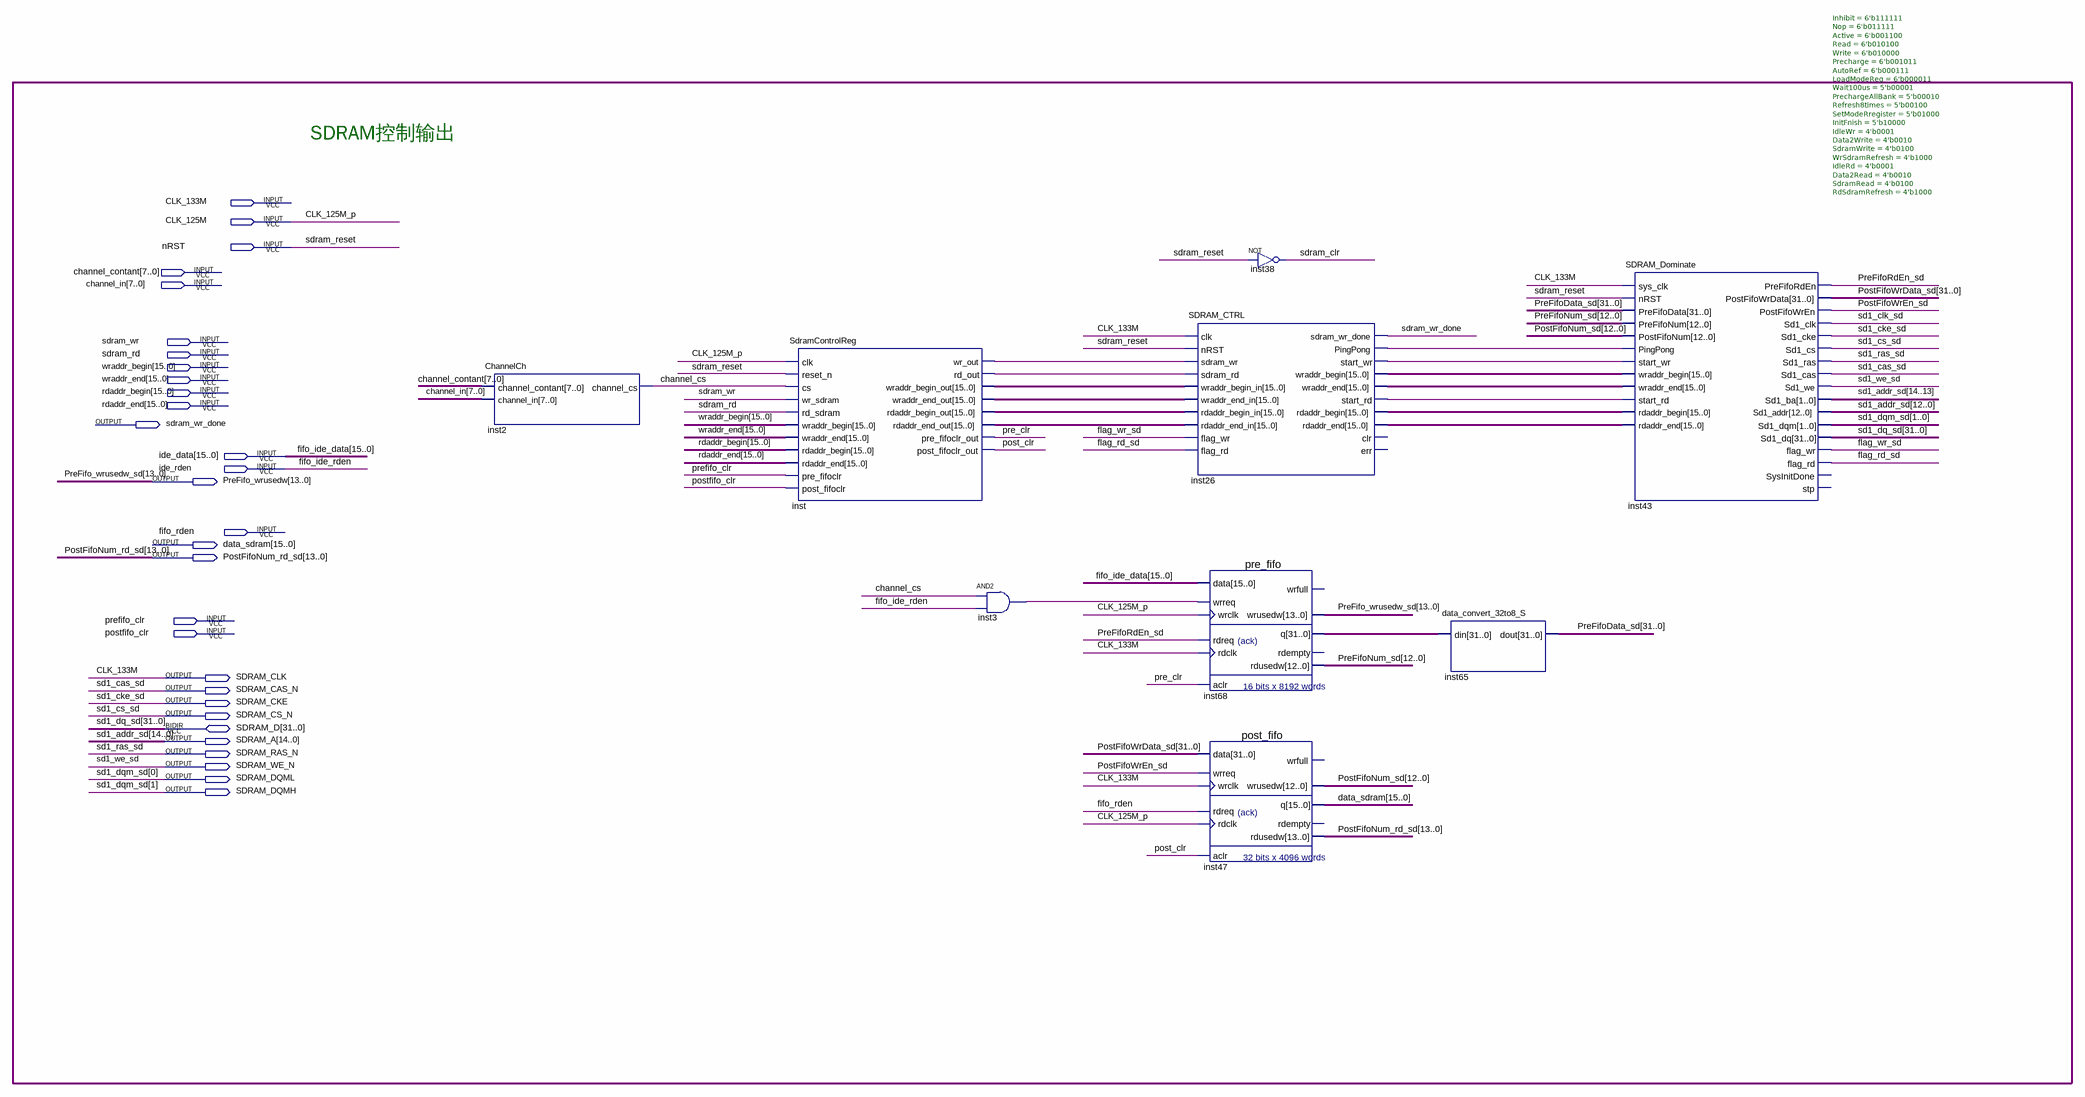
[diagram p0: schematic sheet]
// Quartus schematic sdram_ctrl_blk.bdf as structural Verilog: 9 symbols, 30 pins
module sdram_ctrl_blk (
  input  CLK_133M,
  input  CLK_125M,
  input  nRST,
  input  [7:0] channel_contant,
  input  [7:0] channel_in,
  input  sdram_wr,
  input  sdram_rd,
  input  [15:0] wraddr_begin,
  input  [15:0] wraddr_end,
  input  [15:0] rdaddr_begin,
  input  [15:0] rdaddr_end,
  input  [15:0] ide_data,
  input  ide_rden,
  input  fifo_rden,
  input  prefifo_clr,
  input  postfifo_clr,
  inout  [31:0] SDRAM_D,
  output sdram_wr_done,
  output [13:0] PreFifo_wrusedw,
  output [15:0] data_sdram,
  output [13:0] PostFifoNum_rd_sd,
  output SDRAM_CLK,
  output SDRAM_CAS_N,
  output SDRAM_CKE,
  output SDRAM_CS_N,
  output [14:0] SDRAM_A,
  output SDRAM_RAS_N,
  output SDRAM_WE_N,
  output SDRAM_DQML,
  output SDRAM_DQMH
);

  wire channel_cs, flag_rd_sd, flag_wr_sd, inst3_out, inst26_pingpong, inst26_start_rd, inst26_start_wr,
       inst_rd_out, inst_wr_out, post_clr, PostFifoWrEn_sd, pre_clr, PreFifoRdEn_sd, sd1_clk_sd, sdram_clr;
  wire [12:0] PostFifoNum_sd, PreFifoNum_sd;
  wire [15:0] inst26_rdaddr_begin, inst26_rdaddr_end, inst26_wraddr_begin, inst26_wraddr_end,
       inst_rdaddr_begin_out, inst_rdaddr_end_out, inst_wraddr_begin_out, inst_wraddr_end_out;
  wire [31:0] inst68_q, PostFifoWrData_sd, PreFifoData_sd;

  ChannelCh inst2 (.channel_contant(channel_contant), .channel_in(channel_in), .channel_cs(channel_cs));
  SdramControlReg inst (
    .clk(CLK_125M), .reset_n(nRST), .cs(channel_cs), .wr_sdram(sdram_wr), .rd_sdram(sdram_rd),
    .wraddr_begin(wraddr_begin), .wraddr_end(wraddr_end), .rdaddr_begin(rdaddr_begin),
    .rdaddr_end(rdaddr_end), .pre_fifoclr(prefifo_clr), .post_fifoclr(postfifo_clr), .wr_out(inst_wr_out),
    .rd_out(inst_rd_out), .wraddr_begin_out(inst_wraddr_begin_out), .wraddr_end_out(inst_wraddr_end_out),
    .rdaddr_begin_out(inst_rdaddr_begin_out), .rdaddr_end_out(inst_rdaddr_end_out),
    .pre_fifoclr_out(pre_clr), .post_fifoclr_out(post_clr));
  and inst3 (inst3_out, channel_cs, ide_rden);
  SDRAM_CTRL inst26 (
    .clk(CLK_133M), .nRST(nRST), .sdram_wr(inst_wr_out), .sdram_rd(inst_rd_out),
    .wraddr_begin_in(inst_wraddr_begin_out), .wraddr_end_in(inst_wraddr_end_out),
    .rdaddr_begin_in(inst_rdaddr_begin_out), .rdaddr_end_in(inst_rdaddr_end_out), .flag_wr(flag_wr_sd),
    .flag_rd(flag_rd_sd), .sdram_wr_done(sdram_wr_done), .PingPong(inst26_pingpong),
    .start_wr(inst26_start_wr), .wraddr_begin(inst26_wraddr_begin), .wraddr_end(inst26_wraddr_end),
    .start_rd(inst26_start_rd), .rdaddr_begin(inst26_rdaddr_begin), .rdaddr_end(inst26_rdaddr_end));  // open: clr, err
  pre_fifo inst68 (
    .data(ide_data), .wrreq(inst3_out), .wrclk(CLK_125M), .rdreq(PreFifoRdEn_sd), .rdclk(CLK_133M),
    .aclr(pre_clr), .wrusedw(PreFifo_wrusedw), .q(inst68_q), .rdusedw(PreFifoNum_sd));  // open: wrfull, rdempty
  post_fifo inst47 (
    .data(PostFifoWrData_sd), .wrreq(PostFifoWrEn_sd), .wrclk(CLK_133M), .rdreq(fifo_rden), .rdclk(CLK_125M),
    .aclr(post_clr), .wrusedw(PostFifoNum_sd), .q(data_sdram), .rdusedw(PostFifoNum_rd_sd));  // open: wrfull, rdempty
  not inst38 (sdram_clr, nRST);
  data_convert_32to8_S inst65 (.din(inst68_q), .dout(PreFifoData_sd));
  SDRAM_Dominate #(.Inhibit(6'b111111), .Nop(6'b011111), .Active(6'b001100), .Read(6'b010100), .Write(6'b010000), .Precharge(6'b001011), .AutoRef(6'b000111), .LoadModeReg(6'b000011), .Wait100us(5'b00001), .PrechargeAllBank(5'b00010), .Refresh8times(5'b00100), .SetModeRregister(5'b01000), .InitFnish(5'b10000), .IdleWr(4'b0001), .Data2Write(4'b0010), .SdramWrite(4'b0100), .WrSdramRefresh(4'b1000), .IdleRd(4'b0001), .Data2Read(4'b0010), .SdramRead(4'b0100), .RdSdramRefresh(4'b1000)) inst43 (
    .sys_clk(CLK_133M), .nRST(nRST), .PreFifoData(PreFifoData_sd), .PreFifoNum(PreFifoNum_sd),
    .PostFifoNum(PostFifoNum_sd), .PingPong(inst26_pingpong), .start_wr(inst26_start_wr),
    .wraddr_begin(inst26_wraddr_begin), .wraddr_end(inst26_wraddr_end), .start_rd(inst26_start_rd),
    .rdaddr_begin(inst26_rdaddr_begin), .rdaddr_end(inst26_rdaddr_end), .PreFifoRdEn(PreFifoRdEn_sd),
    .PostFifoWrData(PostFifoWrData_sd), .PostFifoWrEn(PostFifoWrEn_sd), .Sd1_clk(sd1_clk_sd),
    .Sd1_cke(SDRAM_CKE), .Sd1_cs(SDRAM_CS_N), .Sd1_ras(SDRAM_RAS_N), .Sd1_cas(SDRAM_CAS_N),
    .Sd1_we(SDRAM_WE_N), .Sd1_ba(SDRAM_A[14:13]), .Sd1_addr(SDRAM_A[12:0]),
    .Sd1_dqm({SDRAM_DQMH, SDRAM_DQML}), .flag_wr(flag_wr_sd), .flag_rd(flag_rd_sd), .Sd1_dq(SDRAM_D));  // open: SysInitDone, stp

  assign SDRAM_CLK = CLK_133M;

  // Other names for the same wires on the sheet: CLK_125M_p = CLK_125M; fifo_ide_data[15:0] = ide_data;
  //   fifo_ide_rden = ide_rden; PreFifo_wrusedw_sd[13:0] = PreFifo_wrusedw; sd1_addr_sd[14:0] = SDRAM_A;
  //   sd1_cas_sd = SDRAM_CAS_N; sd1_cke_sd = SDRAM_CKE; sd1_cs_sd = SDRAM_CS_N; sd1_dq_sd[31:0] = SDRAM_D;
  //   sd1_dqm_sd[1:0] = {SDRAM_DQMH, SDRAM_DQML}; sd1_ras_sd = SDRAM_RAS_N; sd1_we_sd = SDRAM_WE_N;
  //   sdram_reset = nRST

  // Notes on the sheet:
  //   SDRAM控制输出
endmodule
